# Altium schematic sheet DACs.SchDoc: FMC_ADC
size 420 x 297 mm; Author: G.Kasprowicz; CompanyName: WUT ISE; DrawnBy: G.Kasprowicz; Organization: WUT ISE; Address1: PW ISE; Address2: Nowowiejska 15/19 00-665 Warsaw; Address3: gkasprow@gmail.com; Revision: 2; SheetNumber: -; SheetTotal: -; ModifiedBy: -; CheckedDate: -; Title2: CFD Offset DAC; DivGrp: WUT ISE; Designer: G.Kasprowicz; ModifiedDate: -; ProjectName: Sensor Box
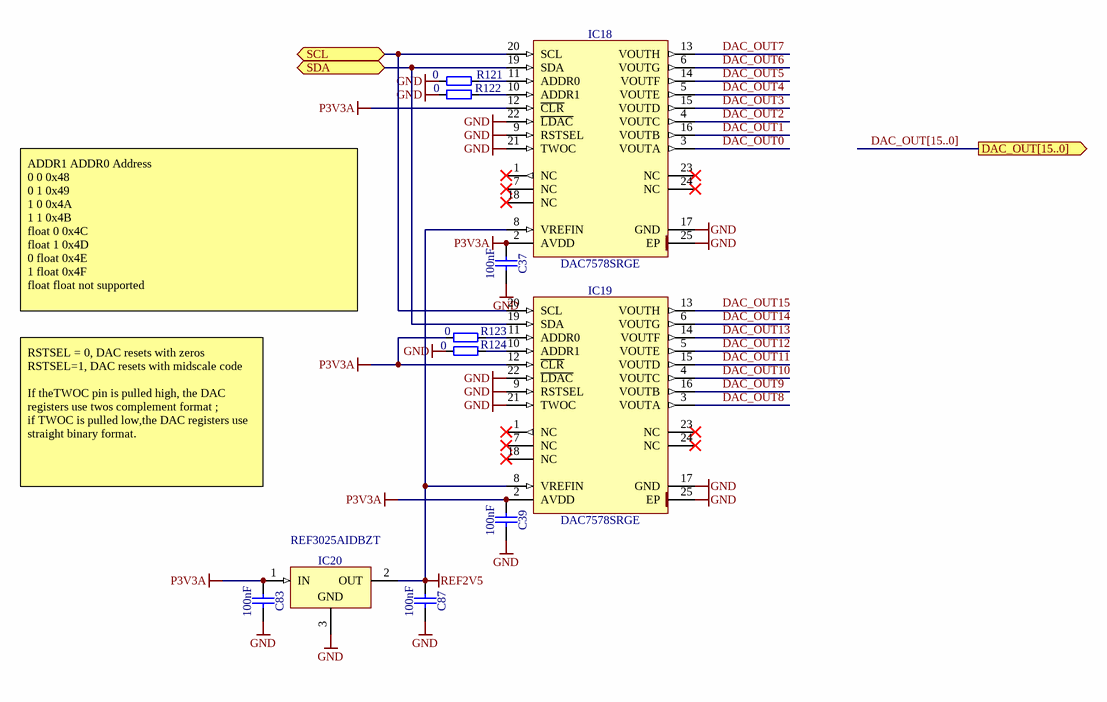
[diagram p0: DACs.SchDoc]

## Parts
C37  100nF  [CAPC0603X33N]
C39  100nF  [CAPC0603X33N]
C83  100nF  [CAPC0603X33N]
C87  100nF  [CAPC0603X33N]
IC18  DAC7578SRGE  [QFN50P400X400X100-25N-S280]
IC19  DAC7578SRGE  [QFN50P400X400X100-25N-S280]
IC20  REF3025AIDBZT  [SOT95P237X112-3N]
R121  0  [RESC1005X40N]
R122  0  [RESC1005X40N]
R123  0  [RESC1005X40N]
R124  0  [RESC1005X40N]

## Ports
DAC_OUT[15..0] (out), SCL (bidir), SDA (bidir)

## Nets
GND: C37.2 C39.2 C83.2 C87.2 IC18.9(RSTSEL) IC18.17(GND) IC18.21(TWOC) IC18.22(~{LDAC}) IC18.25(EP) IC19.9(RSTSEL) IC19.17(GND) IC19.21(TWOC) IC19.22(~{LDAC}) IC19.25(EP) IC20.3(GND) R121.1 R122.1 R124.1
P3V3A: C37.1 C39.1 C83.1 IC18.2(AVDD) IC18.12(~{CLR}) IC19.2(AVDD) IC19.12(~{CLR}) IC20.1(IN) R123.1
REF2V5: C87.1 IC18.8(VREFIN) IC19.8(VREFIN) IC20.2(OUT)
DAC_OUT0: IC18.3(VOUTA)
DAC_OUT1: IC18.16(VOUTB)
DAC_OUT2: IC18.4(VOUTC)
DAC_OUT3: IC18.15(VOUTD)
DAC_OUT4: IC18.5(VOUTE)
DAC_OUT5: IC18.14(VOUTF)
DAC_OUT6: IC18.6(VOUTG)
DAC_OUT7: IC18.13(VOUTH)
DAC_OUT8: IC19.3(VOUTA)
DAC_OUT9: IC19.16(VOUTB)
DAC_OUT10: IC19.4(VOUTC)
DAC_OUT11: IC19.15(VOUTD)
DAC_OUT12: IC19.5(VOUTE)
DAC_OUT13: IC19.14(VOUTF)
DAC_OUT14: IC19.6(VOUTG)
DAC_OUT15: IC19.13(VOUTH)
SCL: IC18.20(SCL) IC19.20(SCL) ; port SCL
SDA: IC18.19(SDA) IC19.19(SDA) ; port SDA
NetIC18_10: IC18.10(ADDR1) R122.2
NetIC18_11: IC18.11(ADDR0) R121.2
NetIC19_10: IC19.10(ADDR1) R124.2
NetIC19_11: IC19.11(ADDR0) R123.2

Not connected (* = marked no-connect by the designer): IC18 1(NC)* 7(NC)* 18(NC)* 23(NC)* 24(NC)*; IC19 1(NC)* 7(NC)* 18(NC)* 23(NC)* 24(NC)*

## Buses and harness runs
bus DAC_OUT[15..0] = port DAC_OUT[15..0]

## Notes on the sheet
- ADDR1	ADDR0	Address
  0	0	0x48
  0	1	0x49
  1	0	0x4A
  1	1	0x4B
  float	0	0x4C
  float	1	0x4D
  0	float	0x4E
  1	float	0x4F
  float	float	not supported
- RSTSEL = 0, DAC resets with zeros
  RSTSEL=1, DAC resets with midscale code
  If theTWOC pin is pulled high, the DAC registers use twos complement format ;
  if TWOC is pulled low,the DAC registers use straight binary format.
- Project/Equipment
- Document
- Designer
- Drawn by
- Check.by
- Copyright WUT ISE 2018.
  This documentation describes Open Hardware and is licensed under the CERN OHL v.1.1. You may redistribute and modify this documentation under the terms of the CERN OHL v.1.1. (http://ohwr.org/CERNOHL). This documentation is distributed WITHOUT ANY EXPRESS OR IMPLIED WARRANTY, INCLUDING OF MERCHANTABILITY, SATISFACTORY QUALITY AND FITNESS FOR A PARTICULAR PURPOSE. Please see the CERN OHL v.1.1 for applicable conditions.
- Contact
- File
- Last Mod.
- Print Date
- Sheet
- Size
- A3
- of
- Rev

## Library data of the parts
C37 C39 C83 C87 = CC0201_100NF_6.3V_10%_X5R: Non-polarised capacitor; Part Description: SMD Multilayer Chip Ceramic Capacitor; Manufacturer: GENERIC; Manufacturer1 Part Number: 02016D104KAT2A; Voltage: 6.3V; TC: X5R; Tolerance: ±10%; Part Number: CC0201_100NF_6.3V_10%_X5R; Component Kind: Standard; Component Type: Standard; Pin Count: 2; Value: 100nF; Status: Not Recommended; Manufacturer Part Number: CC0201_100NF_6.3V_10%_X5R; Case: 0201; Mounted: Yes; Socket: No; SMD: Yes; Sense: No; Manufacturer1 Example: AVX; Manufacturer1 ComponentHeight: 0.33mm; HelpURL: \\cern.ch\dfs\Applications\Altium\Datasheets\CC0201_X5R_AVX.pdf; Author: CERN DEM JLC; CreateDate: 03.12.2007; LatestRevisionDate: 03.12.2007
IC18 IC19 = DAC7578SRGE: 8-Bit, Octal-Channel, Ultra-Low Glitch, Voltage Output, Two-Wire Interface Digital-to-Analog Converter; Part Description: 12-Bit, Octal-Channel, Ultra-Low Glitch, Voltage Output, Two-Wire Interface Digital-To-Analog Converters; Manufacturer: TEXAS INSTRUMENTS; PressFit: No; Bonding: No; Part Number: DAC7578SRGE; Component Kind: Standard; Component Type: Standard; Device: DAC7578SRGE; PackageDescription: QFN, 0.50mm Pitch, Square; 24 Pin, 4.00mm L X 4.00mm W X 1.00mm H body(w/thermal tab 2.8 X 2.8mm), IPC Medium Density; Manufacturer Part Number: DAC7578SRGE; Pin Count: 25; Case: QFN24; Mounted: Yes; Socket: No; SMD: Yes; Sense: No; ComponentHeight: 1mm; Author: CERN DEM MR; HelpURL: \\cern.ch\dfs\Applications\Altium\Datasheets\DAC7578SRGE.pdf; CreateDate: 14.07.2016; LatestRevisionDate: 14.07.2016
IC20 = REF3025AIDBZT: 3-Terminal Regulator 1=IN 2=OUT 3=GND; Part Description: 2.5V, 50ppm/°C Max, 50uA, CMOS Voltage Reference; Manufacturer: TEXAS INSTRUMENTS; PressFit: No; Bonding: No; Part Number: REF3025AIDBZT; Component Kind: Standard; Component Type: Standard; Device: REF3025AIDBZT; PackageDescription: SOT, 0.95mm, pitch; 3 pin,1.30mm W X 2.92mm L X 1.12mm H body, IPC Medium Density; Manufacturer Part Number: REF3025AIDBZT; Pin Count: 3; Case: SOT23; Mounted: Yes; Socket: No; SMD: Yes; Sense: No; ComponentHeight: 1.12mm; HelpURL: \\cern.ch\dfs\Applications\Altium\Datasheets\REF3025AIDBZT.pdf; Author: CERN DEM JLC; CreateDate: 19.12.2016; LatestRevisionDate: 19.12.2016
R121-R124 = R0402_0R_JUMPER: Resistor; Part Description: 1A (0.05R Max DC Resistance) Zero Ohm Jumper; Manufacturer: GENERIC; Manufacturer1 Part Number: 232270591001L; PressFit: No; Part Number: R0402_0R_JUMPER; Component Kind: Standard; Component Type: Standard; Pin Count: 2; Value: 0; Status: Not Recommended; Manufacturer Part Number: R0402_0R_JUMPER; Case: 0402; Mounted: Yes; Sense: No; Socket: No; SMD: Yes; Manufacturer1 Example: YAGEO PHYCOMP; Manufacturer1 ComponentHeight: 0.4mm; HelpURL: \\cern.ch\dfs\Applications\Altium\Datasheets\R0402_Phycomp_RC0402.pdf; Author: CERN DEM JLC; CreateDate: 03.12.2007; LatestRevisionDate: 17.10.2012